# Altium schematic sheet Synch_demod.SchDoc: Force Stage
size Tabloid; DocumentNumber: LM-002; Revision: A; SheetNumber: 1; SheetTotal: 2; DocumentName: LM-002; ProjectName: LM-002
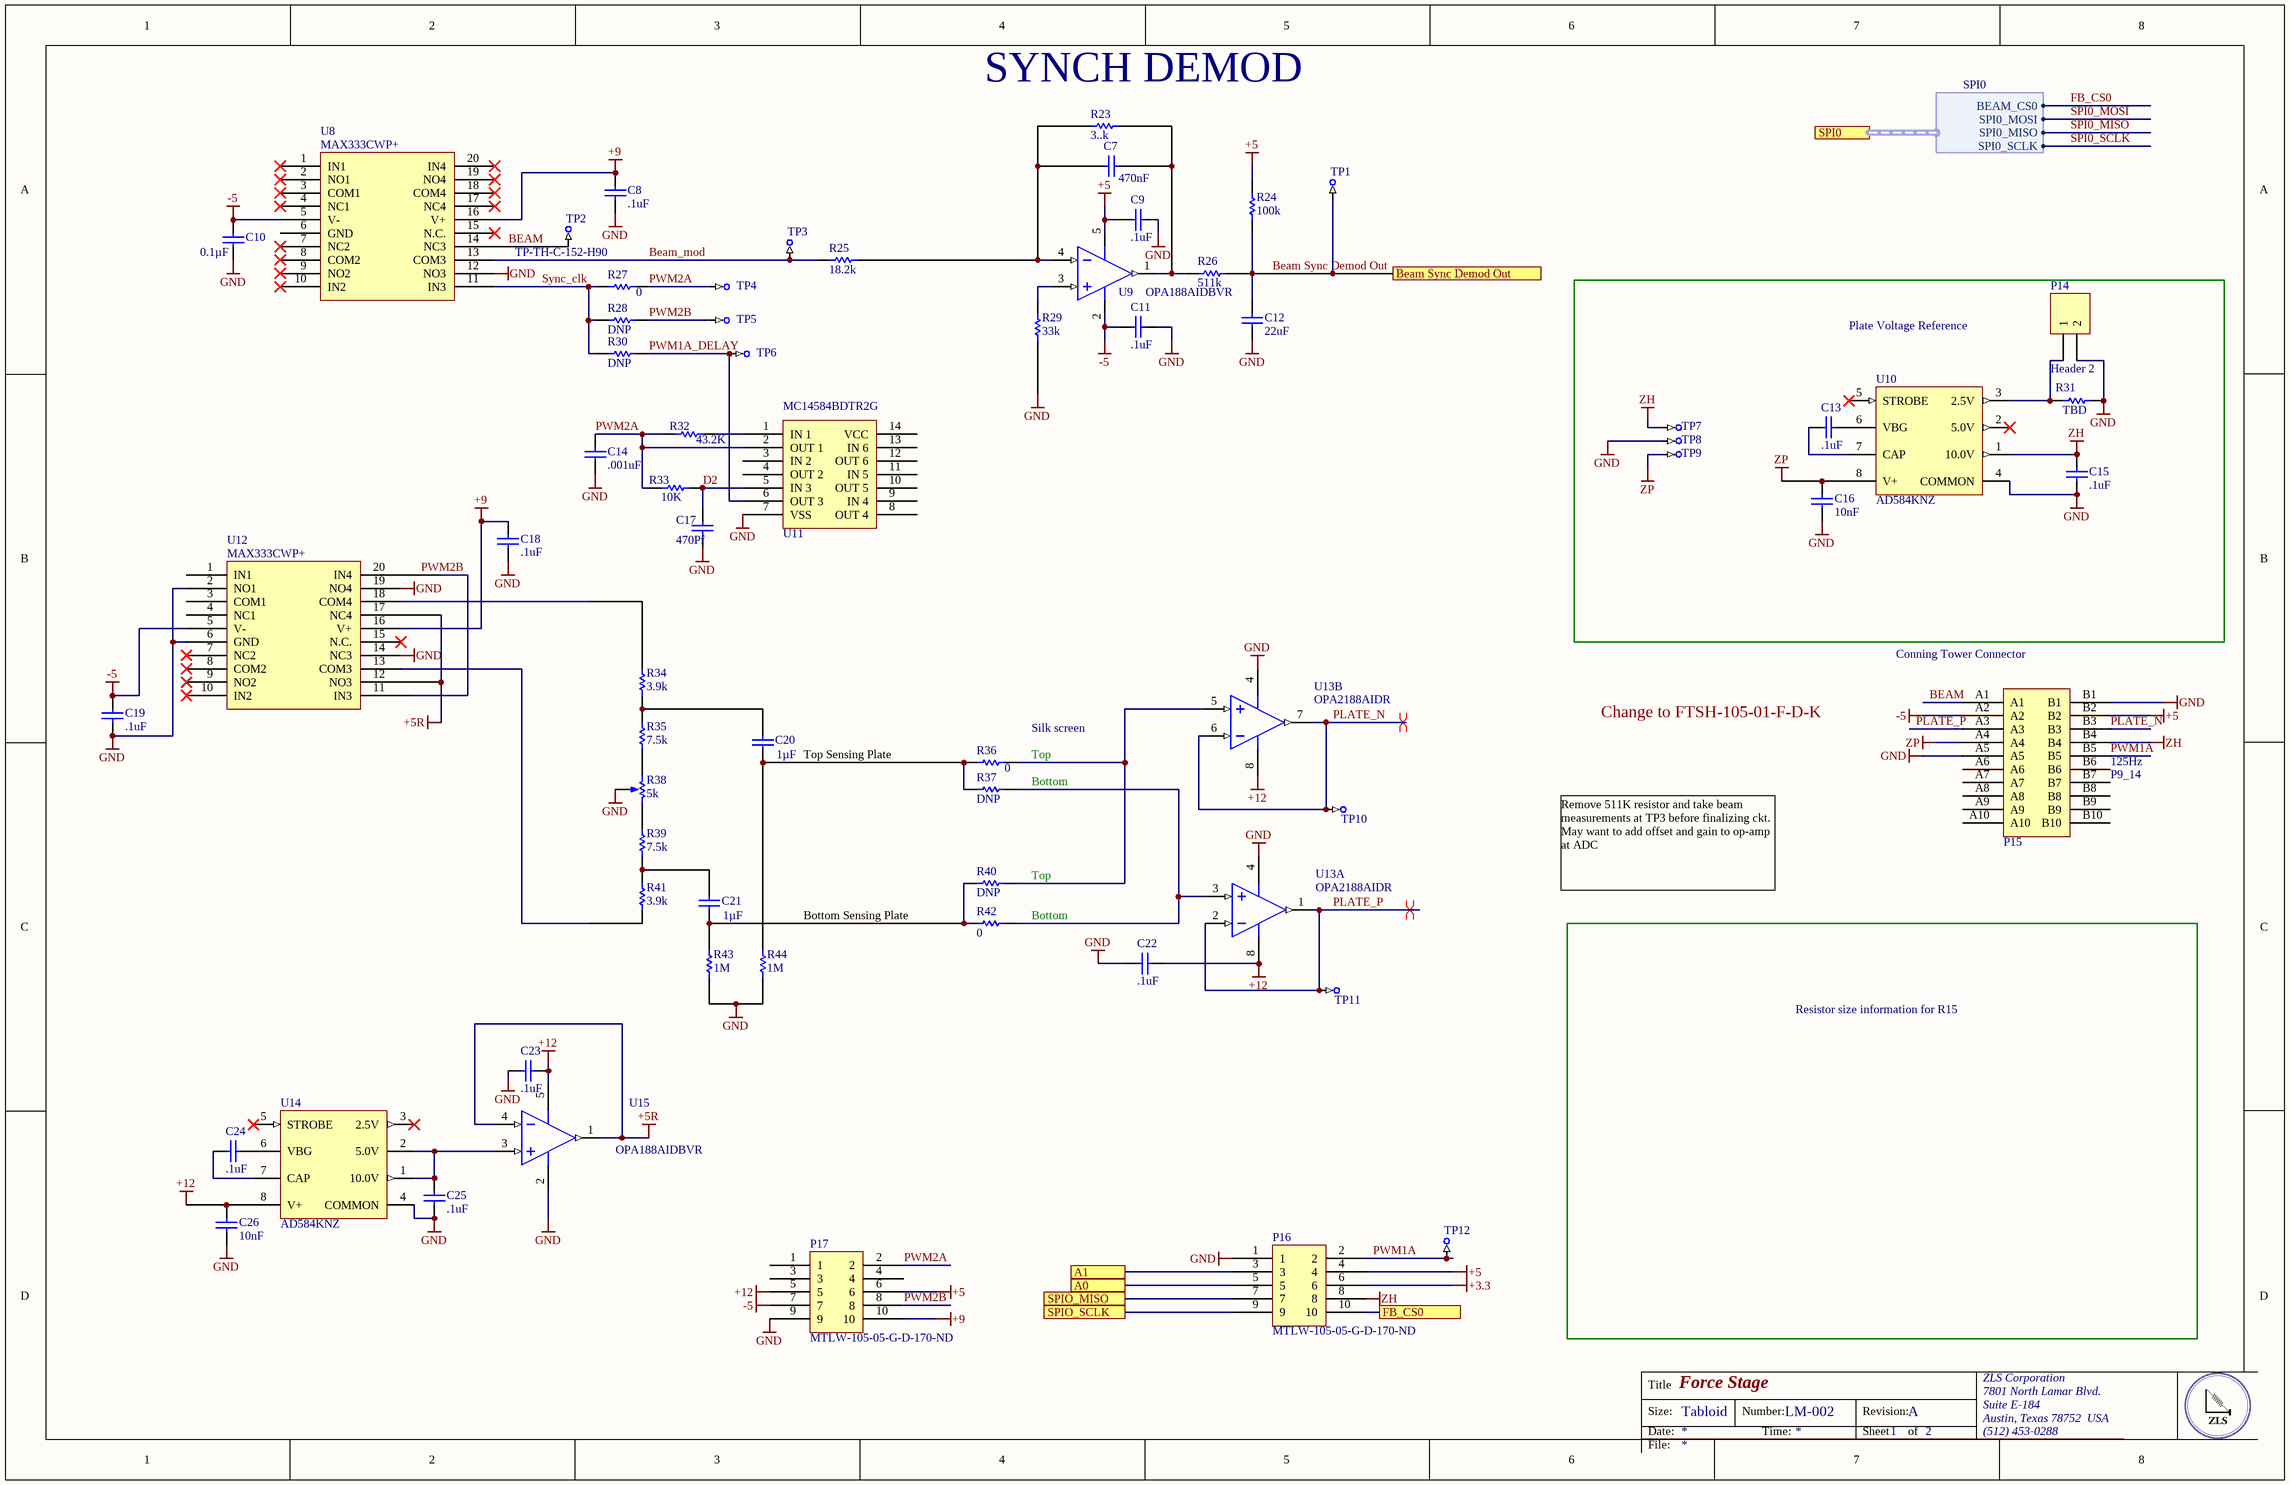
[diagram p0: Synch_demod.SchDoc]

## Parts
C7  470nF  [CAPC0805(2012)75_L]
C8  .1uF  [CAPC0805(2012)75_L]
C9  .1uF  [CAPC0805(2012)75_L]
C10  Capacitance: 0.1µF  [CAPC0805(2012)145_N]  (hidden comment: CAP CER 0.1UF 25V X7R 0805)
C11  .1uF  [CAPC0805(2012)75_L]
C12  22uF  [CAPC0805(2012)75_L]
C13  .1uF  [CAPC0805(2012)75_M]
C14  .001uF  [CAPC0805(2012)75_L]
C15  .1uF  [CAPC0805(2012)75_M]
C16  Capacitance: 10nF  [CAPC0805(2012)145_N]  (hidden comment: Multilayer Ceramic Capacitors MLCC - SMD/SMT 0.01uF 50volts 10% X7R)
C17  470Pf  [CAPC0805(2012)75_L]
C18  .1uF  [CAPC0805(2012)75_M]
C19  .1uF  [CAPC0805(2012)75_M]
C20  Capacitance: 1µF  [CAPC0805(2012)155_L]  (hidden comment: CAP CER 1UF 25V X7R 0805)
C21  Capacitance: 1µF  [CAPC0805(2012)155_L]  (hidden comment: CAP CER 1UF 25V X7R 0805)
C22  .1uF  [CAPC0805(2012)75_M]
C23  .1uF  [CAPC0805(2012)75_M]
C24  .1uF  [CAPC0805(2012)75_M]
C25  .1uF  [CAPC0805(2012)75_M]
C26  Capacitance: 10nF  [CAPC0805(2012)145_N]  (hidden comment: Multilayer Ceramic Capacitors MLCC - SMD/SMT 0.01uF 50volts 10% X7R)
P14  Header 2  [HDR1X2]
P15  MEC6-110-0-PCB  [MEC6-110-02-L-DV]  (value not drawn)
P16  Supplier Part Number 1: MTLW-105-05-G-D-170-ND  [TLW-105-05-G-D]  (hidden comment: TLW-105-05-G-D)
P17  Supplier Part Number 1: MTLW-105-05-G-D-170-ND  [TLW-105-05-G-D]  (hidden comment: TLW-105-05-G-D)
R23  3..k  [RESC0805(2012)_L]
R24  100k  [RESC0805(2012)_L]
R25  18.2k  [RESC0805(2012)_L]
R26  511k  [RESC0805(2012)_L]
R27  0  [RESC0805(2012)_L]
R28  DNP  [RESC0805(2012)_L]
R29  33k  [RESC0805(2012)_L]
R30  DNP  [RESC0805(2012)_L]
R31  TBD  [VH102K]
R32  43.2K  [RESC0805(2012)_L]
R33  10K  [RESC0805(2012)_L]
R34  3.9k  [RESC0805(2012)_L]
R35  7.5k  [RESC0805(2012)_L]
R36  0  [RESC0805(2012)_L]
R37  DNP  [RESC0805(2012)_L]
R38  Resistance (Ohms): 5k  [Trimmer 2.54]  (hidden comment: TRIMMER 5K OHM 0.25W PC PIN)
R39  7.5k  [RESC0805(2012)_L]
R40  DNP  [RESC0805(2012)_L]
R41  3.9k  [RESC0805(2012)_L]
R42  0  [RESC0805(2012)_L]
R43  1M  [RESC0805(2012)_L]
R44  1M  [RESC0805(2012)_L]
TP1  TP-TH-C-152-H90  [TP-TH-C-152-H90]  (value not drawn)  (no BOM)
TP2  TP-TH-C-152-H90  [TP-TH-C-152-H90]  (no BOM)
TP3  TP-TH-C-152-H90  [TP-TH-C-152-H90]  (value not drawn)  (no BOM)
TP4  TP-TH-C-152-H90  [TP-TH-C-152-H90]  (value not drawn)  (no BOM)
TP5  TP-TH-C-152-H90  [TP-TH-C-152-H90]  (value not drawn)  (no BOM)
TP6  TP-TH-C-152-H90  [TP-TH-C-152-H90]  (value not drawn)  (no BOM)
TP7  TP-TH-C-152-H90  [TP-TH-C-152-H90]  (value not drawn)  (no BOM)
TP8  TP-TH-C-152-H90  [TP-TH-C-152-H90]  (value not drawn)  (no BOM)
TP9  TP-TH-C-152-H90  [TP-TH-C-152-H90]  (value not drawn)  (no BOM)
TP10  TP-TH-C-152-H90  [TP-TH-C-152-H90]  (value not drawn)  (no BOM)
TP11  TP-TH-C-152-H90  [TP-TH-C-152-H90]  (value not drawn)  (no BOM)
TP12  TP-TH-C-152-H90  [TP-TH-C-152-H90]  (value not drawn)  (no BOM)
U8  MAX333CWP+  [TSOP65P640X90-20N]
U9  OPA188AIDBVR  [DBV0005A_M]
U10  AD584KNZ  [ADI-N-8]
U11  MC14584BDTR2G  [MC14584BDTR2G]
U12  MAX333CWP+  [TSOP65P640X90-20N]
U13  OPA2188AIDR  [D0008A_L]  (parts A,B of 2)
U14  AD584KNZ  [ADI-N-8]
U15  OPA188AIDBVR  [DBV0005A_M]

## Blocks framed on the sheet
Plate Voltage Reference: C13 C15 C16 P14 R31 TP7-TP9 U10

## Ports
A0, A1, Beam Sync Demod Out, FB_CS0, SPI0 (harness SPI0), SPIO_MISO, SPIO_SCLK

## Harnesses
SPI0: BEAM_CS0, SPI0_MOSI, SPI0_MISO, SPI0_SCLK

## Nets
+3.3: P16.6
+5: C9.1 P15.B2 P16.4 P17.6 R24.2 U9.5(V+)
+5R: U12.12(NO3) U12.17(NC4) U15.1(OUT) U15.4(IN-)
+9: C8.2 C18.2 P17.10 U8.16(V+) U12.16(V+)
+12: C22.2 C23.2 C26.1 P17.5 U13.8(V+) U14.8(V+) U15.5(V+)
-5: C10.1 C11.1 C19.2 P15.A2 P17.7 U8.5(V-) U9.2(V-) U12.5(V-)
GND: C8.1 C9.2 C10.2 C11.2 C12.1 C14.1 C15.1 C16.2 C17.1 C18.1 C19.1 C22.1 C23.1 C25.1 C26.2 P14.2 P15.A5 P15.B1 P16.1 P17.9 R29.1 R31.2 R38.2(b) R43.1 R44.1 TP8.1 U8.12(NO3) U10.4(COMMON) U11.7(VSS) U12.2(NO1) U12.6(GND) U12.14(NC3) U12.19(NO4) U13.4(V-) U14.4(COMMON) U15.2(V-)
ZH: C15.2 P15.B4 P16.8 TP7.1 U10.1(10.0V)
ZP: C16.1 P15.A4 TP9.1 U10.8(V+)
A0: P16.5 ; port A0
A1: P16.3 ; port A1
BEAM: P15.A1 TP2.1 U8.14(NC3)
Beam Sync Demod Out: C12.2 R24.1 R26.1 TP1.1 ; port Beam Sync Demod Out
Beam_mod: R25.2 TP3.1 U8.13(COM3)
D2: C17.2 R33.1 U11.5(IN_3)
FB_CS0: P16.10 ; port FB_CS0
FB_CS0: port SPI0.BEAM_CS0  [a separate net that carries the same name]
PLATE_N: P15.B3 TP10.1 U13.6(IN_B-) U13.7(OUT_B)
PLATE_P: P15.A3 TP11.1 U13.1(OUT_A) U13.2(IN_A-)
PWM1A: P15.B5 P16.2 TP12.1
PWM1A_DELAY: R30.1 TP6.1 U11.6(OUT_3)
PWM2A: C14.2 P17.2 R27.1 R32.2 R33.2 TP4.1 U11.2(OUT_1)
PWM2B: P17.8 R28.1 TP5.1 U12.11(IN3) U12.20(IN4)
SPI0_MISO: port SPI0.SPI0_MISO
SPI0_MOSI: port SPI0.SPI0_MOSI
SPI0_SCLK: port SPI0.SPI0_SCLK
SPIO_MISO: P16.7 ; port SPIO_MISO
SPIO_SCLK: P16.9 ; port SPIO_SCLK
Sync_clk: R27.2 R28.2 R30.2 U8.11(IN3)
NetC7_1: C7.1 R23.2 R25.1 U9.4(IN-)
NetC7_2: C7.2 R23.1 R26.2 U9.1(OUT)
NetC13_1: C13.1 U10.7(CAP)
NetC13_2: C13.2 U10.6(VBG)
NetC20_1: C20.1 R36.2 R37.2 R44.2
NetC20_2: C20.2 R34.1 R35.2
NetC21_1: C21.1 R40.2 R42.2 R43.2
NetC21_2: C21.2 R39.1 R41.2
NetC24_1: C24.1 U14.7(CAP)
NetC24_2: C24.2 U14.6(VBG)
NetC25_2: C25.2 U14.1(10.0V) U14.2(5.0V) U15.3(IN+)
NetP14_1: P14.1 R31.1 U10.3(2.5V)
NetR29_2: R29.2 U9.3(IN+)
NetR32_1: R32.1 U11.1(IN_1)
NetR34_2: R34.2 U12.18(COM4)
NetR35_1: R35.1 R38.1(a)
NetR36_1: R36.1 R40.1 U13.5(IN_B+)
NetR37_1: R37.1 R42.1 U13.3(IN_A+)
NetR38_3: R38.3(c) R39.2
NetR41_1: R41.1 U12.13(COM3)

Not connected (* = marked no-connect by the designer): P15 A6 A7 A8 A9 A10 B6 B7 B8 B9 B10; P17 1 3 4; U8 1(IN1)* 2(NO1)* 3(COM1)* 4(NC1)* 6(GND) 7(NC2)* 8(COM2)* 9(NO2)* 10(IN2)* 15(N.C.)* 17(NC4)* 18(COM4)* 19(NO4)* 20(IN4)*; U10 2(5.0V)* 5(STROBE)*; U11 3(IN_2) 4(OUT_2) 8(OUT_4) 9(IN_4) 10(OUT_5) 11(IN_5) 12(OUT_6) 13(IN_6) 14(VCC); U12 1(IN1) 3(COM1) 4(NC1) 7(NC2)* 8(COM2)* 9(NO2)* 10(IN2)* 15(N.C.)*; U14 3(2.5V)* 5(STROBE)*

## Layout directives
differential pair: PLATE_N, PLATE_P

## Notes on the sheet
- (near R23) SYNCH DEMOD
- (near P15) Conning Tower Connector
- (near C20) Top Sensing Plate
- Silk screen
- Top
- Change to FTSH-105-01-F-D-K
- (near P15) 125Hz
- Bottom
- (near P15) P9_14
- (near R40) Top
- Remove 511K resistor and take beam measurements at TP3 before finalizing ckt.
  May want to add offset and gain to op-amp at ADC
- Bottom Sensing Plate
- Resistor size information for R15
- Title
- Size:
- Date:
- Tabloid
- Number:
- Time:
- Revision:
- Sheet
- of
- ZLS Corporation
- 7801 North Lamar Blvd.
- Suite E-184
- Austin, Texas 78752  USA
- (512) 453-0288
- File:

## Library data of the parts
C7 = CMP-1036-02117-1: CAP 150pF 16V ±10% 0805 (2012 Metric) Thickness 0.75mm SMD; Case-EIA: 0805; Tolerance: Â±10%; Value: .47uF; Case-Metric: 2012; Technology: SMT; Max Thickness: 0.75 mm; Rated Voltage: 16 V
C8 C9 C11 C12 C14 C17 = CMP-1036-02117-1: CAP 150pF 16V ±10% 0805 (2012 Metric) Thickness 0.75mm SMD; Case-EIA: 0805; Tolerance: Â±10%; Case-Metric: 2012; Technology: SMT; Max Thickness: 0.75 mm; Rated Voltage: 16 V
  C8 C9 C11: Value: .1uF
  C12: Value: 22uF
  C14: Value: .001uF
  C17: Value: 470Pf
C10 = CMP-1036-04795-1: Manufacturer: Murata Electronics North America; Manufacturer Part Number: GRM21BR71E104KA01L; Tolerance: ±10%; Supplier 1: Digi-Key; Supplier Part Number 1: 490-1673-6-ND; RoHS: RoHS Compliant; Category: Capacitors; Stock 1: 891652; Pricing 1: 1=0.2, 10=0.145, 100=0.0683, 500=0.04788, 1000=0.03964 (USD); Packaging: Digi-Reel®; Part Status: Active; Voltage - Rated: 25V; Temperature Coefficient: X7R; Operating Temperature: -55°C ~ 125°C; Features: -; Ratings: -; Applications: General Purpose; Mounting Type: Surface Mount, MLCC; Package / Case: 0805 (2012 Metric); Size / Dimension: 0.079" L x 0.049" W (2.00mm x 1.25mm); Height - Seated (Max): -; Thickness (Max): 0.053" (1.35mm); Lead Spacing: -; Lead Style: -; ComponentLink1URL: http://www.murata.com/~/media/webrenewal/support/library/catalog/products/capacitor/mlcc/c02e.ashx; ComponentLink1Description: http://www.murata.com/~/media/webrenewal/support/library/catalog/products/capacitor/mlcc/c02e.ashx
C13 C15 C18 C19 C22-C25 = CMP-1036-01414-1: CAP 33pF 25V ±2% 0805 (2012 Metric) Thickness 0.75mm SMD; Tolerance: Â±2%; Case-Metric: 2012; Case-EIA: 0805; Value: .1uF; Max Thickness: 0.75 mm; Rated Voltage: 25 V; Technology: SMT
C16 C26 = CMP-1036-04795-1: Manufacturer: Kemet; Manufacturer Part Number: C0805C103K5RACAUTO; Voltage Rating: 50V; Supplier 1: Digi-Key; Supplier Part Number 1: 399-6924-1-ND; Stock 1: 63236; Pricing 1: 1=0.12, 10=0.087, 100=0.041, 500=0.0287, 1000=0.0238 (USD); Mount: Surface Mount; Case/Package: 0805; Case Code (Metric): 2012; Case Code (Imperial): 0805; Dielectric Material: Ceramic; Contact Plating: Tin; Min Operating Temperature: -55°C; Max Operating Temperature: 125°C; Tolerance: 10%; Packaging: Tape and Reel; Package Quantity: 1; Voltage Rating (DC): 50V; Dielectric: X7R; Termination: SMD/SMT; Length: 2mm; Height: 0.78mm; Width: 0.049inch; Thickness: 0.035inch; Depth: 1.25mm; Radiation Hardening: No; REACH SVHC: No SVHC; ComponentLink1URL: https://datasheet.ciiva.com/22700/1693454-22700519.pdf; ComponentLink1Description: https://datasheet.ciiva.com/22700/1693454-22700519.pdf; ComponentLink2URL: https://datasheet.ciiva.com/7842/1693454-7842175.pdf; ComponentLink2Description: https://datasheet.ciiva.com/7842/1693454-7842175.pdf
C20 C21 = CMP-1036-04882-1: Manufacturer: Murata Electronics North America; Manufacturer Part Number: GRM21BR71E105KA99L; Tolerance: ±10%; Supplier 1: Digi-Key; Supplier Part Number 1: 490-6484-6-ND; RoHS: RoHS Compliant; Category: Capacitors; Stock 1: 295074; Pricing 1: 1=0.14, 10=0.099, 100=0.0468, 500=0.0328, 1000=0.02715 (USD); Packaging: Digi-Reel®; Part Status: Active; Voltage - Rated: 25V; Temperature Coefficient: X7R; Operating Temperature: -55°C ~ 125°C; Features: -; Ratings: -; Applications: General Purpose; Mounting Type: Surface Mount, MLCC; Package / Case: 0805 (2012 Metric); Size / Dimension: 0.079" L x 0.049" W (2.00mm x 1.25mm); Height - Seated (Max): -; Thickness (Max): 0.053" (1.35mm); Lead Spacing: -; Lead Style: -; ComponentLink1URL: http://www.murata.com/~/media/webrenewal/support/library/catalog/products/capacitor/mlcc/c02e.ashx; ComponentLink1Description: http://www.murata.com/~/media/webrenewal/support/library/catalog/products/capacitor/mlcc/c02e.ashx
P14 = Header 2: Header, 2-Pin; LatestRevisionDate: 17-Jul-2002; LatestRevisionNote: Re-released for DXP Platform.; Publisher: Altium Limited
P16 P17 = TLW-105-05-G-D: Manufacturer: Samtec Inc.; Manufacturer Part Number: MTLW-105-05-G-D-170; Connector Type: Header; Pitch - Mating: 0.100" (2.54mm); Number of Positions: 10; Number of Positions Loaded: All; Style: Board to Board or Cable; Shrouding: Unshrouded; Contact Length - Mating: 0.170" (4.32mm); Contact Length - Post: 0.105" (2.67mm); Overall Contact Length: 0.335" (8.51mm); Material Flammability Rating: UL94 V-0; Current Rating: 5.2A per Contact; Supplier 1: Digi-Key; RoHS: RoHS Compliant; Category: Connectors, Interconnects; Stock 1: 0; Pricing 1: 1=1.79 (USD); Packaging: Tube; Part Status: Active; Contact Type: Male Pin; Number of Rows: 2; Row Spacing - Mating: 0.100" (2.54mm); Mounting Type: Through Hole; Termination: Solder; Fastening Type: Push-Pull; Insulation Height: 0.060" (1.52mm); Contact Shape: Square; Contact Finish - Mating: Gold; Contact Finish Thickness - Mating: 10µin (0.25µm); Contact Finish - Post: Gold; Contact Material: Phosphor Bronze; Insulation Material: Liquid Crystal Polymer (LCP); Features: -; Operating Temperature: -55°C ~ 125°C; Ingress Protection: -; Insulation Color: Black; Voltage Rating: -; Mated Stacking Heights: -; Contact Finish Thickness - Post: 3µin (0.08µm); Applications: -; ComponentLink1URL: http://suddendocs.samtec.com/prints/mtlw-1xx-xx-xx-x-xxx-xx-xx-mkt1.pdf; ComponentLink1Description: http://suddendocs.samtec.com/prints/mtlw-1xx-xx-xx-x-xxx-xx-xx-mkt1.pdf
R23 = CMP-1013-00215-1: 2R55 0.125W 1% 0805 (2012 Metric)  SMD; Case-Metric: 2012; Value: 300k; Case-EIA: 0805; Tolerance: 1 %; Technology: SMT; Power: 0.125 W
R24-R27 R29 R32-R36 R39 R41-R44 = CMP-1013-00215-1: 2R55 0.125W 1% 0805 (2012 Metric)  SMD; Case-Metric: 2012; Case-EIA: 0805; Tolerance: 1 %; Technology: SMT; Power: 0.125 W
  R24: Value: 100k
  R25: Value: 18.2k
  R26: Value: 511k
  R27 R36 R42: Value: 0
  R29: Value: 33k
  R32: Value: 43.2K
  R33: Value: 10K
  R34 R41: Value: 3.9k
  R35 R39: Value: 7.5k
  R43 R44: Value: 1M
R28 R30 R37 R40 = CMP-1013-00215-1: 2R55 0.125W 1% 0805 (2012 Metric)  SMD; Case-Metric: 2012; Value: 0; Case-EIA: 0805; Tolerance: 1 %; Technology: SMT; Power: 0.125 W
R31 = CMP-1013-00393-1
R38 = Trimmer: Manufacturer: Vishay Foil Resistors (Division of Vishay Precision Group); Manufacturer Part Number: Y00535K00000J0L; Power (Watts): 0.25W, 1/4W; Tolerance: ±5%; Temperature Coefficient: ±10ppm/°C; Number of Turns: 21; Adjustment Type: Side Adjustment; Resistive Material: Metal Foil; Supplier 1: Digi-Key; Supplier Part Number 1: 804-1020-ND; RoHS: RoHS Compliant; Category: Potentiometers, Variable Resistors; Stock 1: 679; Pricing 1: 1=34.42, 10=32.265, 25=26.5292, 50=22.944, 100=22.227, 250=20.793, 500=19.2156 (USD); Packaging: Bulk; Part Status: Active; Mounting Type: Through Hole; Termination Style: PC Pins; Size / Dimension: Rectangular - 0.250" x 0.175" Face x 0.250" L (6.35mm x 4.45mm x 6.35mm); ComponentLink1URL: http://www.vishaypg.com/docs/63053/1240.pdf; ComponentLink1Description: http://www.vishaypg.com/docs/63053/1240.pdf
TP1-TP12 = CMP-0484-00003-2: Test Point, Through Hole, Hole Size 0.9 mm, PCB Mount with Silkscreen Box; Manufacturer: No Vendor; PartNumber: TP-TH-C-152-H90
U8 U12 = MAX333CWP+: IC SWITCH QUAD SPDT 20TSSOP; Manufacturer: Maxim; Manufacturer Part Number: MAX333AEUP+; Max Supply Voltage: 30V; Min Supply Voltage: 10V; Min Dual Supply Voltage: 4.5V; Max Dual Supply Voltage: 20V; On-State Resistance: 35R; Operating Supply Current: 1uA; Supply Type: Single,Dual; Max Power Dissipation: 559mW; Turn-On Delay Time: 175ns; Turn-Off Delay Time: 145ns; Max Supply Current: 250uA; Number of Bits: 4; Dual Supply Voltage: 15V; Supplier 1: Mouser; Supplier Part Number 1: 700-MAX333AEUP; Stock 1: 664; Pricing 1: 1=6.77, 10=6.43, 50=5.8, 100=5.8, 1000=5.62, 10000=5.62 (USD); Case/Package: TSSOP; Number of Pins: 20; Weight: 0.006737oz; Min Operating Temperature: -40°C; Max Operating Temperature: 85°C; Packaging: Rail/Tube; Package Quantity: 74; Throw Configuration: SPDT; Number of Channels: 4; Length: 6.6mm; Height: 0.95mm; Width: 4.5mm; Radiation Hardening: No; Lead Free: Lead Free; REACH SVHC: Unknown; ComponentLink1URL: https://datasheet.ciiva.com/2978/max333a-2978850.pdf; ComponentLink1Description: https://datasheet.ciiva.com/2978/max333a-2978850.pdf; ComponentLink2URL: https://datasheet.ciiva.com/30478/0900766b81253c85-30478260.pdf; ComponentLink2Description: https://datasheet.ciiva.com/30478/0900766b81253c85-30478260.pdf; ComponentLink3URL: https://datasheet.ciiva.com/1674/max333a-1674617.pdf; ComponentLink3Description: https://datasheet.ciiva.com/1674/max333a-1674617.pdf; ComponentLink4URL: https://datasheet.ciiva.com/26825/max333aeup-26825546.pdf; ComponentLink4Description: https://datasheet.ciiva.com/26825/max333aeup-26825546.pdf
U9 U15 = CMP-0809-00005-2: Precision, Low Noise, Rail-to-Rail Output, Zero-Drift Operational Amplifier, 4 to 36 V, -40 to 125 degC, 5-pin SOT23 (DBV5), Green (RoHS & no Sb/Br); Manufacturer: Texas Instruments; Total Supply Voltage(Min)(+5V is 5, +/-5V is 10): 4; Offset Drift(Typ)(uV/C): 0.03; Rating: Catalog; SubFamily: Zero Drift Precision Amplifier; GBW(Typ)(MHz): 2; Slew Rate(Typ)(V/us): 0.8; Number of Channels: 1; CMRR(Min)(dB): 120; Iq per channel(Max)(mA): 0.51; Total Supply Voltage(Max)(+5V is 5, +/-5V is 10): 36; PartNumber: OPA188AIDBVR; ComponentLink2Description: Datasheet; ComponentLink2URL: http://www.ti.com/lit/ds/symlink/opa188.pdf; ComponentLink1Description: Manufacturer URL; Mounting Technology: Surface Mount; Eco-Plan: Green (RoHS & no Sb/Br); ComponentLink1URL: http://www.ti.com/; PackageVersion: 4073253-4/K, 03/2006; DatasheetVersion: SBOS642A; ComponentLink3Description: Package Specification; PackageReference: DBV0005A; ComponentLink3URL: http://www.ti.com/litv/pdf/mpds018i; PackageDescription: 5-Pin Plastic Small Outline, Body 1.6 x 2.9 mm, Pitch 0.95 mm; Code_JEDEC: MO-178
U10 U14 = CMP-0784-00054-1: Pin Programmable, Precision Voltage Reference, + 2.5 / + 5 / + 7.5 / + 10 Prog V Output, 4.5 to 30 V Supply, Commercial, 8-pin DIP (N-8), Tube; Manufacturer: Analog Devices; Max V Supply (V): 30; Min V Supply (V): 4.5; Ref Out TC (ppm/C): 15; Vout: 2.5V, 5V, 7.5V, 10V; ComponentLink3URL: http:/www.analog.com/static/imported-files/packages/PKG_PDF/PDIP(N)/N_8.pdf; ComponentLink1URL: http://www.analog.com/en/index.html; PartNumber: AD584KNZ; ComponentLink1Description: Manufacturer URL; ComponentLink2Description: Datasheet; PackageDescription: 8-Pin Plastic Dual In-Line Package, Row spacing 7.62 mm, Pitch 2.54 mm; Operating Temp Range: 0 to 70 degC; DatasheetVersion: Rev. C; Code_JEDEC: MS-001; Packing: Tube; ComponentLink3Description: Package Specification; PackageReference: N-8; ComponentLink4Description: URL Link1; Mounting Technology: Through Hole; PackageVersion: 070606-A, 07/2006; ComponentLink4URL: Product URL:http://www.analog.com/en/special-linear-functions/voltage-references/ad584/products/product.html; ComponentLink2URL: http://www.analog.com/static/imported-files/data_sheets/AD584.pdf
U11 = MC14584BDTR2G: Manufacturer: ON Semiconductor; Logic Type: Inverter; Number of Inputs: 6; Voltage - Supply: 3 V ~ 18 V; Current - Output High, Low: 8.8mA, 8.8mA; Logic Level - Low: 1.6 V ~ 4.6 V; Logic Level - High: 3.4 V ~ 10.5 V; Max Propagation Delay @ V, Max CL: 80ns @ 15V, 50pF; Supplier 1: Digi-Key; Supplier Part Number 1: MC14584BDTR2GOSCT-ND; Manufacturer Part Number: MC14584BDTR2G; RoHS: RoHS Compliant; Category: Integrated Circuits (ICs); Stock 1: 5429; Pricing 1: 1=0.5, 10=0.43, 100=0.3213, 500=0.25242, 1000=0.19506 (USD); Packaging: Cut Tape (CT); Part Status: Active; Features: Schmitt Trigger; Operating Temperature: -55°C ~ 125°C; Mounting Type: Surface Mount; Supplier Device Package: 14-TSSOP; Package / Case: 14-TSSOP (0.173", 4.40mm Width); Base Part Number: 4584; ComponentLink1URL: http://www.onsemi.com/pub/Collateral/MC14584B-D.PDF; ComponentLink1Description: http://www.onsemi.com/pub/Collateral/MC14584B-D.PDF
U13 = CMP-0272-00241-3: 0.03 uV/degC, 6 uV Vos, Low Noise, Rail-to-Rail Output, Zero-Drift Operational Amplifier, 4 to 36 V, -40 to 105 degC, 8-pin SOIC (D8), Green (RoHS & no Sb/Br); Manufacturer: Texas Instruments; Number of Circuits: 2; Slew Rate: 0.8 V/µs; Current - Supply: 415µA; Current - Output / Channel: 18mA; Voltage - Supply, Single/Dual (±): 4 V ~ 36 V, ±2 V ~ 18 V; Supplier 1: Digi-Key; Supplier Part Number 1: 296-29454-6-ND; Manufacturer Part Number: OPA2188AIDR; RoHS: RoHS Compliant; Category: Integrated Circuits (ICs); Stock 1: 8272; Pricing 1: 1=3.44, 10=3.089, 100=2.5307, 500=2.15434, 1000=1.81692 (USD); Packaging: Digi-Reel®; Part Status: Active; Amplifier Type: Zero-Drift; Output Type: Rail-to-Rail; -3db Bandwidth: -; Operating Temperature: -40°C ~ 105°C; Mounting Type: Surface Mount; Package / Case: 8-SOIC (0.154", 3.90mm Width); Supplier Device Package: 8-SOIC; ComponentLink1URL: http://www.ti.com/lit/ds/symlink/opa2188.pdf; ComponentLink1Description: http://www.ti.com/lit/ds/symlink/opa2188.pdf